# Altium schematic sheet FLYBACK_SWITCHING_POWER_SUPPLY_V1_3.SchDoc
size A4; SheetNumber: 1; SheetTotal: 1
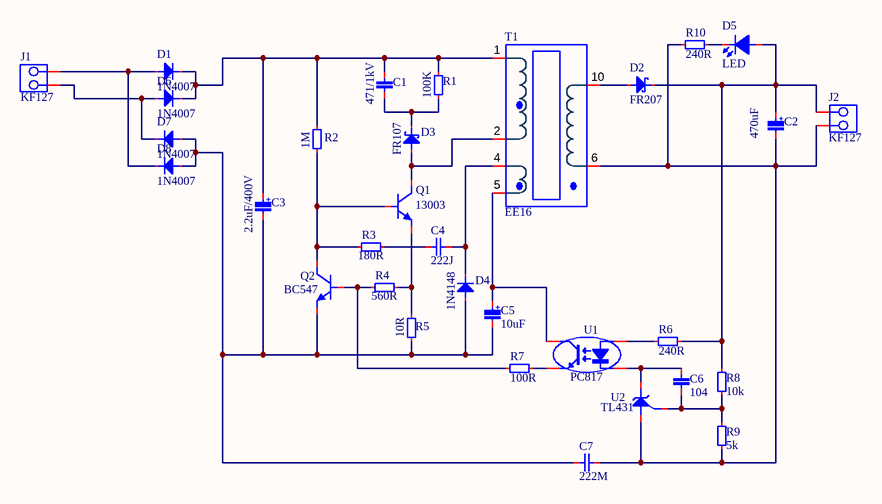
[diagram p0: FLYBACK_SWITCHING_POWER_SUPPLY_V1_3.SchDoc]

## Parts
C1  471/1kV  [CAP_Ceramic_5MM]
C2  470uF  [CAP_RAD_D06.3x11]
C3  2.2uF/400V  [CAP_RAD_D10x12.5]
C4  222J  [CAP-FILM-5MM]
C5  10uF  [CAP_RAD_D05x11]
C6  104  [CAP_Ceramic_5MM]
C7  222M  [CAP_Ceramic_473M_9.65mm]
D1  1N4007  [DO-204AL-BK]
D2  FR207  [DO-204AC-BK]
D3  FR107  [DO-204AL-BK]
D4  1N4148  [DO-204AH-RD]
D5  LED  [LED_5MM]
D6  1N4007  [DO-204AL-BK]
D7  1N4007  [DO-204AL-BK]
D8  1N4007  [DO-204AL-BK]
J1  KF127  [DG127-5.0-02P-14-00AH]
J2  KF127  [DG127-5.0-02P-14-00AH]
Q1  13003  [TO-126]
Q2  BC547  [TO-92]
R1  100K  [RES-0.5W-H]
R2  1M  [RES-0.25W-H]
R3  180R  [RES-0.25W-H]
R4  560R  [RES-0.25W-H]
R5  10R  [RES-0.5W-V]
R6  240R  [RES-0.25W-H]
R7  100R  [RES-0.25W-H]
R8  10k  [RES-0.25W-H]
R9  5k  [RES-0.25W-H]
R10  240R  [RES-0.25W-H]
T1  EE16  [TRANSFORMERS-EE16(5+5)-H]
U1  PC817  [PC817-DIP]
U2  TL431  [TO-92]

## Nets
NetC1_1: C1.1 D3.2 R1.1
NetC1_2: C1.2 C3.1 D1.2 D6.2 R1.2 R2.2 T1.1
NetC2_1: C2.1 D2.2 D5.1(A) J2.1 R6.1 R8.1
NetC2_2: C2.2 C7.2 J2.2 R9.2 R10.2 T1.6 U2.2
NetC3_2: C3.2 C5.2 C7.1 D4.1 D7.1 D8.1 Q2.3(E) R5.2
NetC4_1: C4.1 R3.1
NetC4_2: C4.2 D4.2 T1.4
NetC5_1: C5.1 T1.5 U1.4(C)
NetC6_1: C6.1 U1.2(K) U2.3
NetC6_2: C6.2 R8.2 R9.1 U2.1
NetD1_1: D1.1 D8.2 J1.1
NetD2_1: D2.1 T1.10
NetD3_1: D3.1 Q1.2(C) T1.2
NetD5_2: D5.2(K) R10.1
NetD6_1: D6.1 D7.2 J1.2
NetQ1_1: Q1.1(B) Q2.1(C) R2.1 R3.2
NetQ1_3: Q1.3(E) R4.1 R5.1
NetQ2_2: Q2.2(B) R4.2 R7.2
NetR6_2: R6.2 U1.1(A)
NetR7_1: R7.1 U1.3(E)

## Notes on the sheet
- (in symbol Capacitor(Radian)) +

## Library data of the parts
C1 C6 C7 = Capacitors(Disc)
C2 C3 C5 = Capacitor(Radian)
C4 = Capacitors(film)
D1 D6-D8 = Diode-1N4007
D2 = Diode-FR207
D3 = Diode-FR107: 1A 1000V
D4 = Diode-1N4148: The fast switching diode
D5 = LED 5MM
J1 J2 = DG127-5.0-02P-14-00AH
Q1 = Transistor-MJE13003
Q2 = Transistor-BC547: VCEO: 45 Vdc / VCBO: 50 Vdc / VEBO: 6.0 Vdc
R1-R10 = Resistors THD
T1 = TRANS-EE16-HORIZONTAL(5+5)
U1 = Opto-PC817
U2 = Ic-TL431